# Altium schematic sheet RF_AMPL_001.SchDoc
size 594 x 420 mm; Author: UR4UUZ; CompanyName: UR4UUZ; SheetNumber: 1; SheetTotal: 1; PageSetup: Record=PageOptions|CenterHorizontal=True|CenterVertical=True|PrintScale=0.94|XCorrection=1.00|YCorrection=1.00|PrintKind=1|BorderSize=5000000|LeftOffset=0|BottomOffset=0|Orientation=1|PaperLength=1000|PaperWidth=1000|Scale=100|PaperSource=7|PrintQuality=-4|MediaType=1|DitherType=10|PaperKind=A4|PrintScaleMode=1; DecimalNumber: Підсилювач КХ-діапазону; DocumentName: Sheet1.SCHDOC
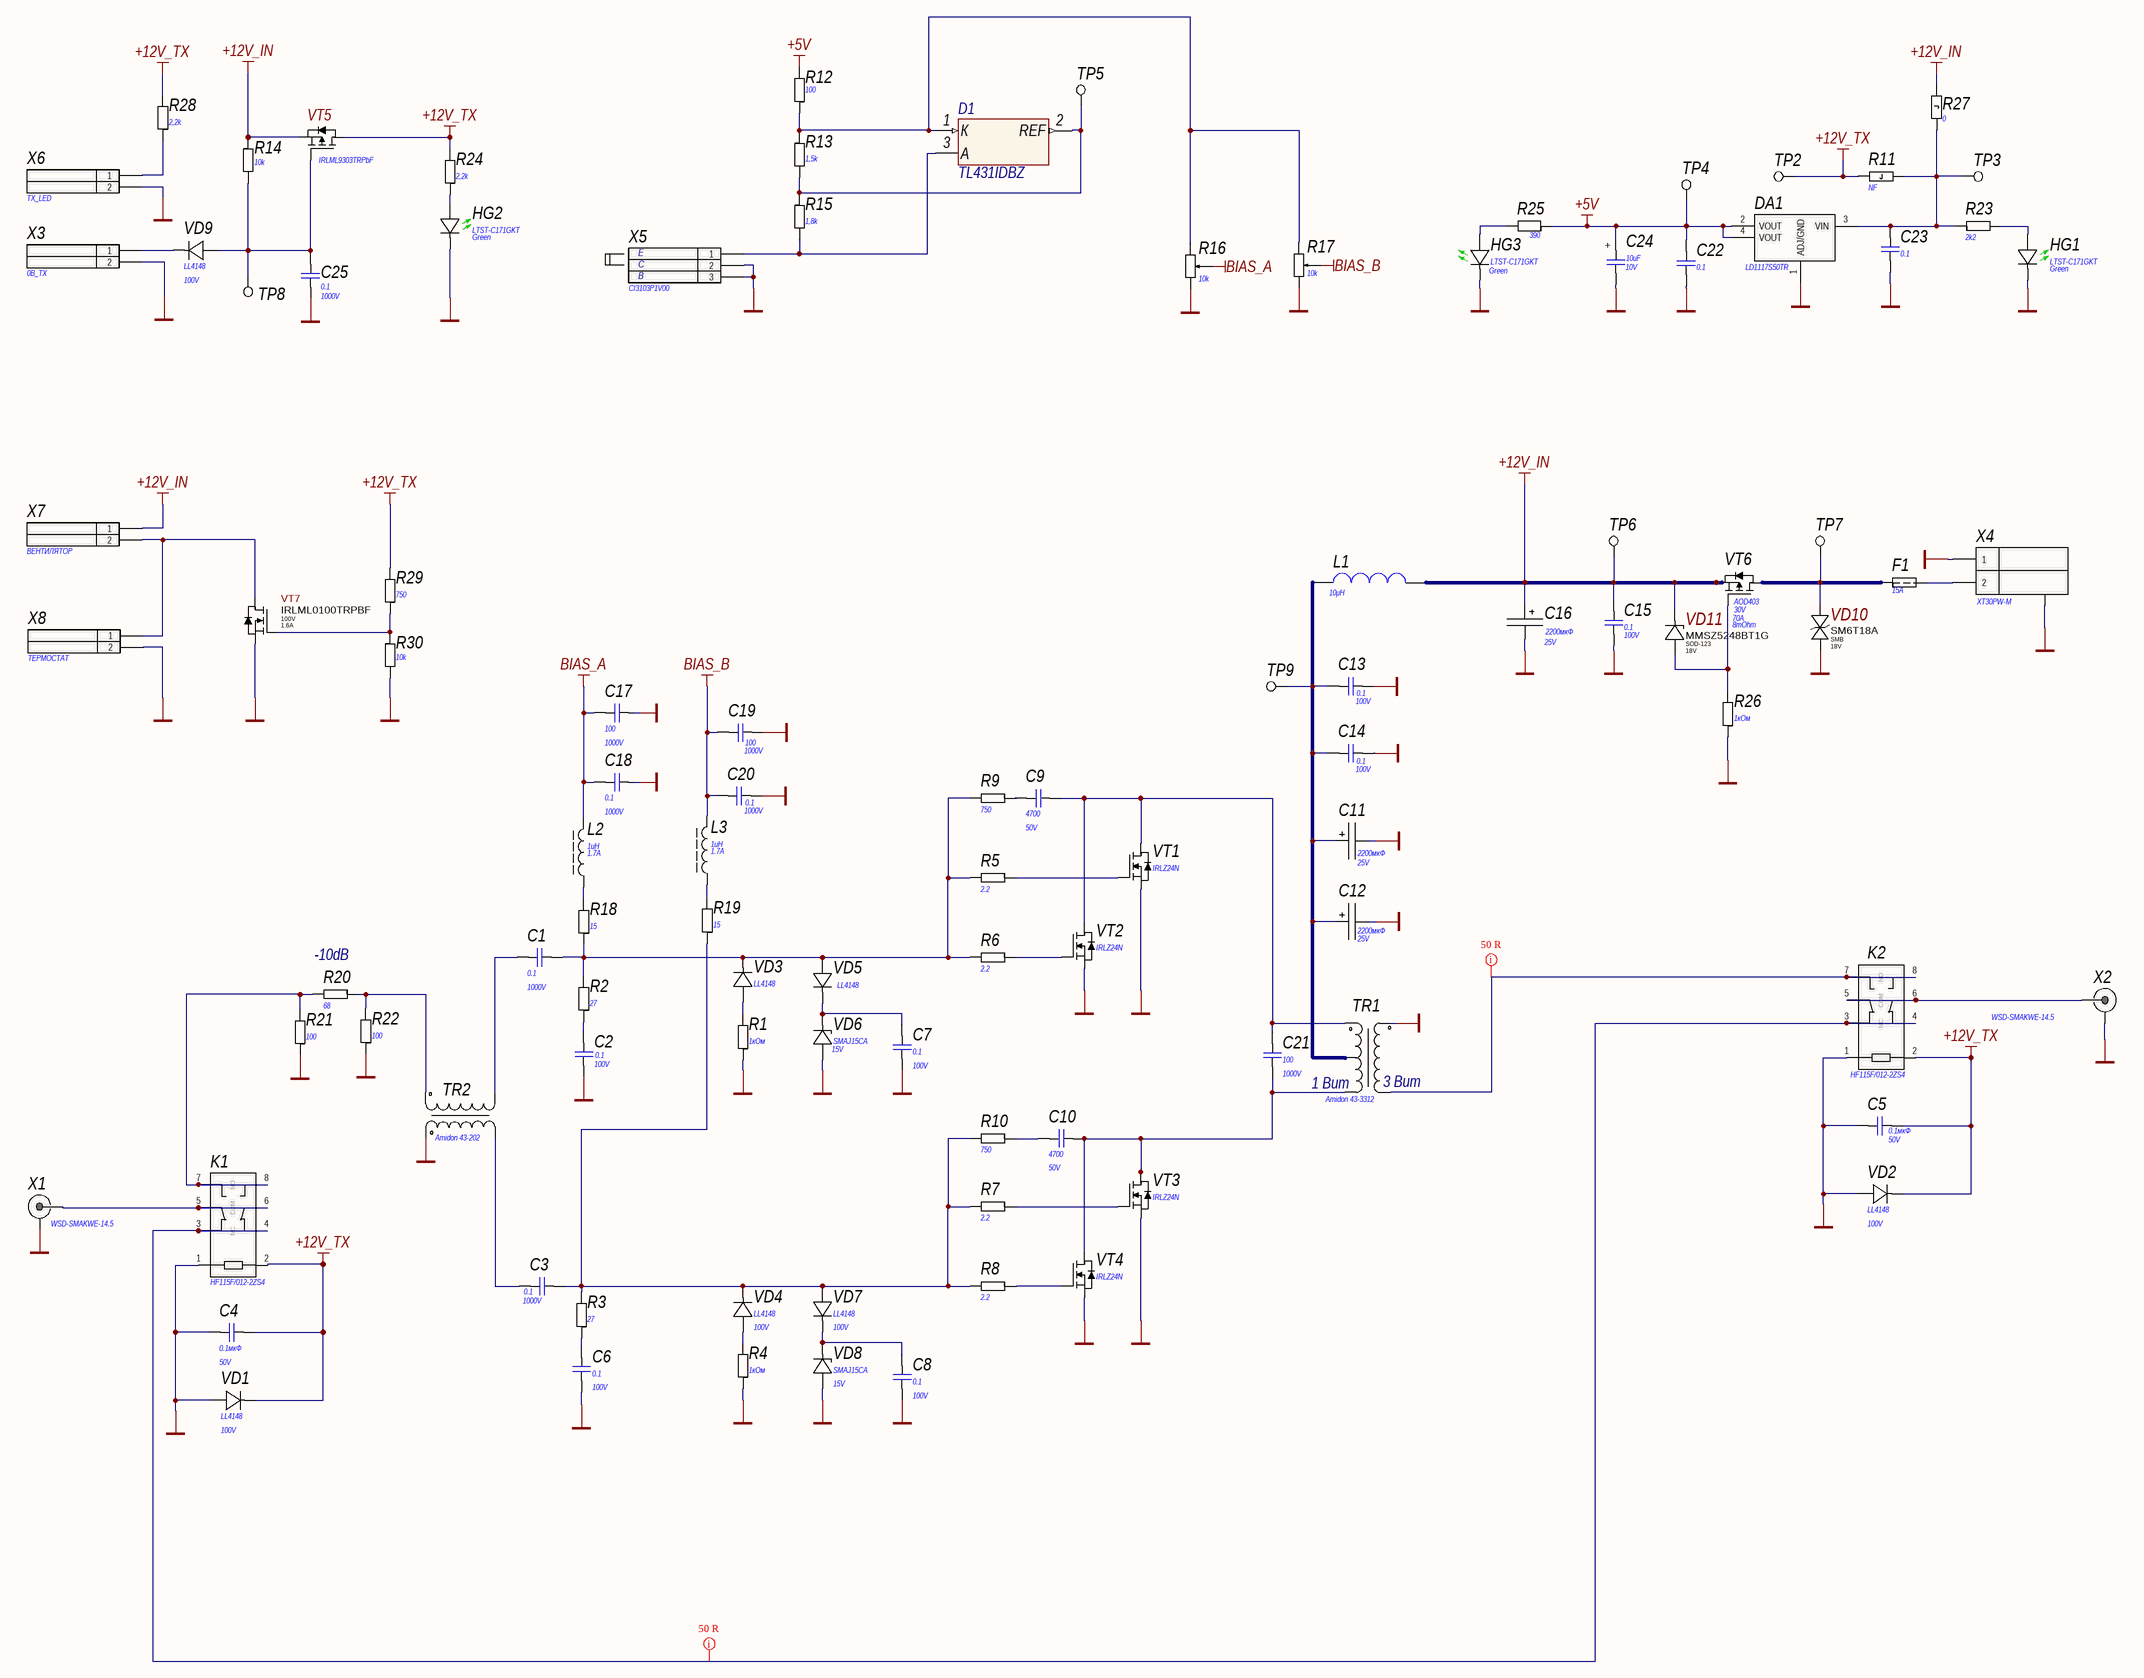
[diagram p0: RF_AMPL_001.SchDoc]

## Parts
C1  Voltage: 1000V  [C_CERAMIC_1206_MED]  (hidden comment: 0.1)
C2  Voltage: 100V  [C_CERAMIC_1206_MED]  (hidden comment: 0.1)
C3  Voltage: 1000V  [C_CERAMIC_1206_MED]  (hidden comment: 0.1)
C4  value 0.1мкФ  Voltage: 50V  [C_CERAMIC_0805_HI]  (hidden comment: 18pF)
C5  value 0.1мкФ  Voltage: 50V  [C_CERAMIC_0805_HI]  (hidden comment: 18pF)
C6  Voltage: 100V  [C_CERAMIC_1206_MED]  (hidden comment: 0.1)
C7  Voltage: 100V  [C_CERAMIC_1206_MED]  (hidden comment: 0.1)
C8  Voltage: 100V  [C_CERAMIC_1206_MED]  (hidden comment: 0.1)
C9  value 4700  Voltage: 50V  [C_CERAMIC_1206_MED]  (hidden comment: 0.1)
C10  value 4700  Voltage: 50V  [C_CERAMIC_1206_MED]  (hidden comment: 0.1)
C11  value 2200мкФ  Voltage: 25V  [CAP: D13C5H20]
C12  value 2200мкФ  Voltage: 25V  [CAP: D13C5H20]
C13  Voltage: 100V  [C_CERAMIC_1206_MED]  (hidden comment: 0.1)
C14  Voltage: 100V  [C_CERAMIC_1206_MED]  (hidden comment: 0.1)
C15  Voltage: 100V  [C_CERAMIC_1206_MED]  (hidden comment: 0.1)
C16  value 2200мкФ  Voltage: 25V  [CAP: D13C5H20]
C17  Voltage: 1000V  [C_CERAMIC_1206_MED]  (hidden comment: 100)
C18  Voltage: 1000V  [C_CERAMIC_1206_MED]  (hidden comment: 0.1)
C19  Voltage: 1000V  [C_CERAMIC_1206_MED]  (hidden comment: 100)
C20  Voltage: 1000V  [C_CERAMIC_1206_MED]  (hidden comment: 0.1)
C21  Voltage: 1000V  [C_CERAMIC_1206_MED]  (hidden comment: 100)
C22  0.1  [C_CERAMIC_1206_MED]
C23  0.1  [C_CERAMIC_1206_MED]
C24  Voltage: 10V  [C_TANTAL_CASE_A_MED]  (hidden comment: 10uF)
C25  Voltage: 1000V  [C_CERAMIC_1206_MED]  (hidden comment: 0.1)
D1  (no value)  [SOT23-3_300X250X110]
DA1  LD1117S50TR  [SOT-223]
F1  Current: 15A  [17861640001]  (hidden comment: STANDART_FUSE_HOLDER)
HG1  Color: Green  [LTST-C171GKT]  (hidden comment: LTST-C171GKT)
HG2  Color: Green  [LTST-C171GKT]  (hidden comment: LTST-C171GKT)
HG3  Color: Green  [LTST-C171GKT]  (hidden comment: LTST-C171GKT)
K1  HF115F/012-2ZS4  [HF115Fxxx-1(2)Zx3(4)]
K2  HF115F/012-2ZS4  [HF115Fxxx-1(2)Zx3(4)]
L1  value 10μH  [IND: R22.9/14/7.62 (H)]
L2  Current: 1.7A  [LQM21PNxxxxGRx_MED]  (hidden comment: 1uH)
L3  Current: 1.7A  [LQM21PNxxxxGRx_MED]  (hidden comment: 1uH)
R1  1кОм  [R_ANY_CHIP_1206_MED]
R2  27  [FKN2WS-Series]
R3  27  [FKN2WS-Series]
R4  1кОм  [R_ANY_CHIP_1206_MED]
R5  2.2  [R_ANY_CHIP_1206_MED]
R6  2.2  [R_ANY_CHIP_1206_MED]
R7  2.2  [R_ANY_CHIP_1206_MED]
R8  2.2  [R_ANY_CHIP_1206_MED]
R9  750  [R_ANY_CHIP_1206_MED]
R10  750  [R_ANY_CHIP_1206_MED]
R11  NF  [R_ANY_CHIP_1206_MED]
R12  100  [R_ANY_CHIP_1206_MED]
R13  1,5k  [R_ANY_CHIP_1206_MED]
R14  10k  [R_ANY_CHIP_1206_MED]
R15  1,8k  [R_ANY_CHIP_1206_MED]
R16  10k  [3296W-1-xxx]
R17  10k  [3296W-1-xxx]
R18  15  [R_ANY_CHIP_1206_MED]
R19  15  [R_ANY_CHIP_1206_MED]
R20  68  [FKN2WS-Series]
R21  100  [FKN2WS-Series]
R22  100  [FKN2WS-Series]
R23  2k2  [R_ANY_CHIP_1206_MED]
R24  2,2k  [R_ANY_CHIP_1206_MED]
R25  390  [R_ANY_CHIP_1206_MED]
R26  1кОм  [R_ANY_CHIP_1206_MED]
R27  0  [R_ANY_CHIP_1206_MED]
R28  2,2k  [R_ANY_CHIP_1206_MED]
R29  750  [R_ANY_CHIP_1206_MED]
R30  10k  [R_ANY_CHIP_1206_MED]
TP2  PAD-1.75mm  [PAD-1.75mm]  (value not drawn)  (no BOM)
TP3  PAD-1.75mm  [PAD-1.75mm]  (value not drawn)  (no BOM)
TP4  PAD-1.75mm  [PAD-1.75mm]  (value not drawn)  (no BOM)
TP5  PAD-1.75mm  [PAD-1.75mm]  (value not drawn)  (no BOM)
TP6  PAD-1.75mm  [PAD-1.75mm]  (value not drawn)  (no BOM)
TP7  PAD-1.75mm  [PAD-1.75mm]  (value not drawn)  (no BOM)
TP8  PAD-1.75mm  [PAD-1.75mm]  (value not drawn)  (no BOM)
TP9  PAD-1.75mm  [PAD-1.75mm]  (value not drawn)  (no BOM)
TR1  Part Number: Amidon 43-3312  [Amidon_43-3312]  (hidden comment: TR)
TR2  Part Number: Amidon 43-202  [Amidon_43-202]  (hidden comment: TR)
VD1  Voltage: 100V  [SOD-80C_MED]  (hidden comment: LL4148)
VD2  Voltage: 100V  [SOD-80C_MED]  (hidden comment: LL4148)
VD3  LL4148  [SOD-80C_MED]
VD4  Voltage: 100V  [SOD-80C_MED]  (hidden comment: LL4148)
VD5  LL4148  [SOD-80C_MED]
VD6  Voltage: 15V  [SMA_MED]  (hidden comment: SMAJ15CA)
VD7  Voltage: 100V  [SOD-80C_MED]  (hidden comment: LL4148)
VD8  Voltage: 15V  [SMA_MED]  (hidden comment: SMAJ15CA)
VD9  Voltage: 100V  [SOD-80C_MED]  (hidden comment: LL4148)
VD10  Package: SMB  Voltage: 18V  [SMB-Bi1_MED]  (hidden comment: SM6T18A)
VD11  Package: SOD-123  Voltage: 18V  [SOD-123_MED]  (hidden comment: MMSZ5248BT1G)
VT1  IRLZ24N  [TO220(H)]
VT2  IRLZ24N  [TO220(H)]
VT3  IRLZ24N  [TO220(H)]
VT4  IRLZ24N  [TO220(H)]
VT5  IRLML9303TRPbF  [SOT-23_MED]
VT6  Vds: 30V  Id: 70A  Rds: 8mOhm  [DPAK_REC]  (hidden comment: AOD403)
VT7  Vds: 100V  Id: 1.6A  [SOT-23_MED]  (hidden comment: IRLML0100TR)
X1  WSD-SMAKWE-14.5  [KLS1-SMA002]
X2  WSD-SMAKWE-14.5  [KLS1-SMA002]
X3  Part Number: 0B_TX  [WF-2R]  (hidden comment: WH-02R)
X4  XT30PW-M  [XT30PW-M]
X5  WH-03S  [WF-3S]  (value not drawn)
X6  Part Number: TX_LED  [WF-2R]  (hidden comment: WH-02R)
X7  Part Number: ВЕНТИЛЯТОР  [WF-2R]  (hidden comment: WH-02R)
X8  Part Number: ТЕРМОСТАТ  [WF-2R]  (hidden comment: WH-02R)

## Nets
+5V: C22.1 C24.1 DA1.2(VOUT) DA1.4(VOUT) R12.1 R25.2 TP4.1
+12V_IN: C15.2 C16.1 L1.1 R14.2 R27.1 TP6.1 VD11.CA VT5.2(S) VT6.3(S) X7.1
+12V_TX: C4.2 C5.2 K1.2(COIL2) K2.2(COIL2) R11.2 R24.1 R28.1 R29.1 TP2.1 VD1.CA VD2.CA VT5.3(D)
BIAS_A: C17.1 C18.1 L2.2 R16.2(WIPER)
BIAS_B: C19.1 C20.1 L3.2 R17.2(WIPER)
GND: C2.1 C4.1 C5.1 C6.1 C7.1 C8.1 C11.2 C12.2 C13.1 C14.1 C15.1 C16.2 C17.2 C18.2 C19.2 C20.2 C22.2 C23.2 C24.2 C25.2 DA1.1(ADJ/GND) HG1.CA(Cathode) HG2.CA(Cathode) HG3.CA(Cathode) K1.1(COIL1) K2.1(COIL1) R1.2 R4.2 R16.3(CW) R17.3(CW) R21.2 R22.2 R26.2 R30.1 TR1.1 TR2.1 VD1.AN VD2.AN VD6.AN VD8.AN VD10.AN1 VT1.3(S) VT2.3(S) VT3.3(S) VT4.3(S) VT7.2(S) X1.2 X2.2 X3.2 X4.1 X4.MP X5.2 X5.3 X6.2 X8.2
NetC1_1: C1.1 TR2.4
NetC1_2: C1.2 R2.1 R5.1 R6.1 R9.1 R18.2 VD3.CA VD5.AN
NetC2_2: C2.2 R2.2
NetC3_1: C3.1 TR2.2
NetC3_2: C3.2 R3.1 R7.1 R8.1 R10.1 R19.2 VD4.CA VD7.AN
NetC6_2: C6.2 R3.2
NetC7_2: C7.2 VD5.CA VD6.CA
NetC8_2: C8.2 VD7.CA VD8.CA
NetC9_1: C9.1 C21.2 TR1.3 VT1.2(D) VT2.2(D)
NetC9_2: C9.2 R9.2
NetC10_1: C10.1 C21.1 TR1.5 VT3.2(D) VT4.2(D)
NetC10_2: C10.2 R10.2
NetC11_1: C11.1 C12.1 C13.2 C14.2 L1.2 TP9.1 TR1.4
NetC23_1: C23.1 DA1.3(VIN) R11.1 R23.2 R27.2 TP3.1
NetC25_1: C25.1 R14.1 TP8.1 VD9.AN VT5.1(G)
NetD1_1: D1.1(К) R12.2 R13.2 R16.1(CCW) R17.1(CCW)
NetD1_2: D1.2(REF) R13.1 R15.2 TP5.1
NetD1_3: D1.3(A) R15.1 X5.1
NetF1_1: F1.1 TP7.1 VD10.AN2 VT6.2(D)
NetF1_2: F1.2 X4.2
NetHG1_AN: HG1.AN(Anode) R23.1
NetHG2_AN: HG2.AN(Anode) R24.2
NetHG3_AN: HG3.AN(Anode) R25.1
NetK1_3: K1.3(1-NC) K1.4(2-NC) K2.3(1-NC) K2.4(2-NC)
NetK1_5: K1.5(1-COM) K1.6(2-COM) X1.1
NetK1_7: K1.7(2-NO) K1.8(2-NO) R20.1 R21.1
NetK2_5: K2.5(1-COM) K2.6(2-COM) X2.1
NetK2_7: K2.7(2-NO) K2.8(2-NO) TR1.2
NetL2_1: L2.1 R18.1
NetL3_1: L3.1 R19.1
NetR1_1: R1.1 VD3.AN
NetR4_1: R4.1 VD4.AN
NetR5_2: R5.2 VT1.1(G)
NetR6_2: R6.2 VT2.1(G)
NetR7_2: R7.2 VT3.1(G)
NetR8_2: R8.2 VT4.1(G)
NetR20_2: R20.2 R22.1 TR2.3
NetR26_1: R26.1 VD11.AN VT6.1(G)
NetR28_2: R28.2 X6.1
NetR29_2: R29.2 R30.2 VT7.1(G)
NetVD9_CA: VD9.CA X3.1
NetVT7_3: VT7.3(D) X7.2 X8.1

## Layout directives
net class CPW: NetK1_3, NetK2_7

## Notes on the sheet
- E
- C
- B
- (near R20) -10dB
- (near TR1) 1 Вит
- (near TR1) 3 Вит
- Перв.примен.
- Справ.№
- Подп. и дата
- Инв.№ дубл.
- Взам.инв.№
- Подп.и дата
- Разраб.
- Изм.
- Лист
- № докум.
- Подп.
- Дата
- Лит.
- Масштаб
- Масса
- Т.контр.
- Пров.
- СХЕМА   ЭЛЕКТРИЧЕСКАЯ
- ПРИНЦИПИАЛЬНАЯ
- Листов
- Инв.№ подл.
- Утв.
- Н.контр.
- Нач.сект.
- Формат  A2
- (in symbol 293D106X9010A2TE3) +
- (in symbol HF115F/012-2ZS4) NO; COM; NC

## Library data of the parts
C1-C3 C6-C8 C13-C15 C17-C21 C25 = 1206B102K102CG: 1nF 1000V X7R ±10% 1206 Ceramic Capacitor RoHS; Manufacturer: Walsin; Standard Lead Time: 31 Weeks; Component Status: Released; Replacement: NONE; Package: 1206; Dielectric Type: X7R; Part Number: 1206B102K102CG; Part Type: Ceramic / X7R / 1206; Component Type: SMD; Temperature Range: -55°C ~ 125°C; Tolerance: ±10%; ComponentLink1URL: https://eu.mouser.com/datasheet/2/210/Middle_and_High_Voltage_DS-1535659.pdf; Supplier 1: Mouser; Supplier Part Number 1: 791-1206B102K102CT; Price: 0; ComponentLink1Description: Datasheet
  C1-C3 C6-C8 C13-C15 C18 C20 C25: Value: 0.1
  C17 C19 C21: Value: 100
C4 C5 = CERAMIC_0805: Part Number: **; Manufacturer: Hitano; Component Status: Released; Tolerance: ±5%; Replacement: NONE; GUID_1C: 32087c8a-96b8-11ea-ab61-0050569f2651; Dielectric Type: C0G/NP0; Part Type: Ceramic / C0G(NP0) / 0402; Component Type: SMD; Temperature Range: -55°C ~ 125°C; ComponentLink1URL: \\altiumdb.ajax.local\files\Datasheet\Capacitor\Hitano-MLCC.pdf; Price: 0; ComponentLink1Description: Datasheet; Package: 0805
C9 C10 = 1206B102K102CG: 1nF 1000V X7R ±10% 1206 Ceramic Capacitor RoHS; Part Number: 12065A472JAT2A; Manufacturer: Walsin; Standard Lead Time: 31 Weeks; Component Status: Released; Replacement: NONE; Package: 1206; Dielectric Type: X7R; Part Type: Ceramic / X7R / 1206; Component Type: SMD; Temperature Range: -55°C ~ 125°C; Tolerance: ±10%; ComponentLink1URL: https://eu.mouser.com/datasheet/2/210/Middle_and_High_Voltage_DS-1535659.pdf; Supplier 1: Mouser; Supplier Part Number 1: 791-1206B102K102CT; Price: 0; ComponentLink1Description: Datasheet
C11 C12 C16 = Aluminium: Manufacturer: Wurth; PartNumber: 860080475013; ValueManufacturerPartNumber: Aluminium capacitor, 2200мкФ, 25V, ±20%, 54mOhm, 14x10x5 mm, -55...+105°C; TypeCapacitor: Aluminium capacitor; Tolerance: ±20%; Impedance: 54mOhm; Package: 14x10x5 mm; HelpURL: https://www.digikey.com/product-detail/en/wurth-electronics-inc/860080475013/732-9029-1-ND/5728972; Temperature: -55...+105°C
C22 C23 = 1206B102K102CG: 1nF 1000V X7R ±10% 1206 Ceramic Capacitor RoHS; Manufacturer: Walsin; Voltage: 100V; Standard Lead Time: 31 Weeks; Component Status: Released; Replacement: NONE; Value: 0.1; Package: 1206; Dielectric Type: X7R; Part Number: 1206B102K102CG; Part Type: Ceramic / X7R / 1206; Component Type: SMD; Temperature Range: -55°C ~ 125°C; Tolerance: ±10%; ComponentLink1URL: https://eu.mouser.com/datasheet/2/210/Middle_and_High_Voltage_DS-1535659.pdf; Supplier 1: Mouser; Supplier Part Number 1: 791-1206B102K102CT; Price: 0; ComponentLink1Description: Datasheet
C24 = 293D106X9010A2TE3: 10uF 10V ±10% Case A Tantalum Capacitor RoHS, 3.4Ohm; Manufacturer: Vishay; Standard Lead Time: 20 Weeks; Component Status: Released; Dielectric Type: NONE; Part Number: 293D106X9010A2TE3; Part Type: Tantalum; Component Type: SMD; Temperature Range: -55°C ~ 125°C; Tolerance: ±10%; ComponentLink1URL: https://eu.mouser.com/datasheet/2/427/293d-1763499.pdf; Supplier 1: Mouser; Supplier Part Number 1: 74-293D106X9010A2TE3; Replacement: NONE; Price: 0.2178; ComponentLink1Description: Datasheet; Package: Case A; Value: 10uF
D1 = TL431IDBZ: Precision Programmable Reference SOT23-3; Manufacturer: Texas Instruments; Type: Мікросхема; Name: TL431IDBZ [Texas Instruments]; Component Function: Voltage Reference; Package: SOT23-3; Mount: SMT; Min Operating Temperature: -40°C; Max Operating Temperature: +85°C; ComponentLink1Description1: *; ComponentLink1Description: Datasheet Link; ComponentLink1Description: New link; Number of Pins: 4; Part Number: TL431IDBZ
DA1 = LD1117S50TR: Adjustable and fixed low drop positive voltage regulator, 5V 800mA, 1.25V to 15V Vin; Manufacturer: STMicroelectronics; Standard Lead Time: 14 Weeks; Component Status: Released; Replacement: NONE; Package: SOT-223; Part Number: LD1117S50TR; Part Type: Power / Linear Regulator; Component Type: SMD; Temperature Range: 0°C ~ 125°C; ComponentLink1URL: https://www.st.com/content/ccc/resource/technical/document/datasheet/99/3b/7d/91/91/51/4b/be/CD00000544.pdf/files/CD00000544.pdf/jcr:content/translations/en.CD00000544.pdf; Supplier 1: Digi-Key; Supplier Part Number 1: 497-6447-2-ND; Price: 0.66; ComponentLink1Description: Datasheet
F1 = STANDART_FUSE_HOLDER: Automotive Fuse holder THT-Mount; Manufacturer_Name: LITTELFUSE; Datasheet Link: https://www.littelfuse.com/media?resourcetype=2d-prints&itemid=dcb90cf3-0771-4ccd-8726-26101cf00574&filename=ol-178.6164.0000(c); Height: 17.5mm; Manufacturer_Part_Number: 17861640001
HG1-HG3 = LTST-C171GKT: Low Power LED, Green 565nm, Clear, SMD 0805, Vf 2.1V - 2.6V, 5 ~ 12mcd @ 20 mA, 130°; Manufacturer: Lite-On Optoelectronics; Component Status: Released; Replacement: NONE; GUID_1C: df39881f-c399-11eb-ab74-0050569f2651; Part Number: LTST-C171GKT; Part Type: LED / 0805; Component Type: SMD; Package: 0805; Wavelength: 565nm; Temperature Range: -55°C ~ 85°C; Supplier 1: Digi-Key; Supplier Part Number 1: 160-1423-2-ND; Price: 0.06; ComponentLink1Description: Datasheet
K1 K2 = HF115F/012-2ZS4: Miniature High Power Relay, DPDT (2 Form C), 12VDC 400mW Coil, 5.0mm 2 Pole 8A AgCdO; Manufacturer: Hongfa; Ajax_1C_ID: 38428; Ajax_1C_PN: HF115F/012-2ZS4 HONGFA, Реле; Ajax_1С_Status: RND Only; Component Status: Released; Replacement: NONE; GUID_1C: 4ba44618-64be-11ec-a90c-00505699469b; Part Number: HF115F/012-2ZS4; Part Type: Relay; Component Type: PTH; Temperature Range: -40°C ~ 85°C; ComponentLink1URL: https://www.tme.eu/Document/2962d862af219292e2e76bbc4b5ef3a2/hf115f.pdf; Supplier 1: TME; Supplier Part Number 1: HF115F/012-2ZS4; Price: 2.27649268; ComponentLink1Description: Datasheet
L1 = Inductor_R22.9/14/7.62: Manufacturer: Magnetics; PartNumber: 0077310A7; ValueManufacturerPartNumber: Fixed inductor, 10μH, ±20%, R22.9/14/7.62, Kool Mu, µ=125, 90 нГн/витков2; TypeInductor: Fixed inductor; TypeMatiriel: Kool Mu; AL: 90 нГн/витков2; MaterialPermeability: µ=125; Tolerance: ±20%; Package: R22.9/14/7.62; HelpURL: http://ferrite.ru/warehouse/r-22-9147-62-77310-a7.html
L2 L3 = LQM21PN1R0MGHL: 1uH Shielded Multilayer Inductor 1.7A 100mOhm Max, 0805; Manufacturer: Murata Electronics; Saturation Current: 1.5A; Tolerance: ±20%; Component Status: Released; Standard Lead Time: 10 Weeks; Replacement: NONE; Value: 1uH; Package: 0805; Part Number: LQM21PN1R0MGHL; Part Type: Power / Multilayer; Component Type: SMD; Temperature Range: -40°C ~ 85°C; ComponentLink1URL: https://eu.mouser.com/datasheet/2/281/1/JELF243B_0040-1699501.pdf; Supplier 1: Mouser; Supplier Part Number 1: 81-LQM21PN1R0MGHL; Price: NONE; ComponentLink1Description: Datasheet
R1 R4 R9 R10 R18 R19 R24 R26 R29 = RC1206FR-071RL: 1 Ohms ±1%, 1/4W 1206 Thick Film Resistor; Manufacturer: Yageo; Ajax_1C_ID: 11059; Ajax_1C_PN: 1R 1% 1206 Resistors SMD RoHS; Ajax_1С_Status: RND Only; Power Rating: 0.25W; Voltage: 200V; Component Status: Released; Temperature Stability: ±200ppm/°C; Replacement: NONE; GUID_1C: 50ee7b76-bfc7-11e7-8199-14dda9d2d04d; Tolerance: ±1%; Package: 1206; Part Number: RC1206FR-071RL; Component Type: SMD; Part Type: Thick Film; Temperature Range: -55°C ~ 155°C; ComponentLink1URL: https://eu.mouser.com/datasheet/2/447/PYu_RC_Group_51_RoHS_L_11-1984063.pdf; Supplier 1: Digi-Key; Supplier Part Number 1: 311-1.00FRTR-ND; Price: 0,0027; ComponentLink1Description: Datasheet
  R1 R4 R26: Value: 1кОм
  R9 R10 R29: Value: 750
  R18 R19: Value: 15
  R24: Value: 2,2k
R2 R3 = FKN2WSJT-73-22R: 22 Ohm ±5%, 2W d4.6mm L11.5mm Axial Through Hole, Fusible, Flameproof, Wirewound Resistor; Manufacturer: Yageo; Ajax_1C_ID: 55873; Ajax_1C_PN: 22R 5% 2W FKN2WSJT-73-22R YAGEO резистор выводной; Ajax_1С_Status: RND Only; Component Status: Released; Temperature Stability: ±350ppm/°C; Replacement: NONE; GUID_1C: 1e7de5d6-6f01-11ed-a366-005056994834; Tolerance: ±5%; Package: Axial 4.6mm, L11.5mm; Value: 27; Part Number: FKN2WSJT-73-22R; Component Type: PTH; Part Type: Wirewound; Power Rating: 2W; Temperature Range: -40°C ~ 155°C; ComponentLink1URL: https://www.yageo.com/upload/media/product/productsearch/datasheet/lr/YAGEO%20FKN_datasheet_2021v0.pdf; Supplier 1: Mouser; Supplier Part Number 1: 603-FKN2WSJT-73-22R; Price: 0,2524; ComponentLink1Description: Datasheet
R5-R8 = RC1206FR-072R4L: 2.42Ohms ±1%, 1/4W 1206 Thick Film Resistor; Manufacturer: Yageo; Ajax_1C_ID: 17368; Ajax_1C_PN: 2.4R 1% 1206 1/4W Resistors SMD RoHS; Ajax_1С_Status: Mass Production; Power Rating: 0.25W; Voltage: 200V; Component Status: Released; Temperature Stability: ±200ppm/°C; Replacement: NONE; GUID_1C: fdd97e3f-df6d-11e9-ab58-0050569f2651; Tolerance: ±1%; Package: 1206; Value: 2.2; Part Number: RC1206FR-072R4L; Component Type: SMD; Part Type: Thick Film; Temperature Range: -55°C ~ 155°C; ComponentLink1URL: https://eu.mouser.com/datasheet/2/447/Yageo_03_18_2021_PYu_RC_Group_51_RoHS_L_11-2199992.pdf; Supplier 1: Mouser; Supplier Part Number 1: 603-RC1206FR-072R4L; Price: 0,0021; ComponentLink1Description: Datasheet
R11 R27 = RC1206JR-070RL: 0 Ohms Jumper, 1/4W 1206 Thick Film Resistor; Manufacturer: Yageo; Tolerance: ±5%; Ajax_1C_ID: 5515; Ajax_1C_PN: 0R 5% 1206 Resistors SMD RoHS; Ajax_1С_Status: Mass Production; Power Rating: 0.25W; Voltage: 200V; Component Status: Released; Temperature Stability: NONE; GUID_1C: 96b6e750-6b2e-11e4-9c1d-a45d36c4a9e5; Package: 1206; Part Number: RC1206JR-070RL; Component Type: SMD; Part Type: Thick Film; Temperature Range: -55°C ~ 155°C; ComponentLink1URL: https://eu.mouser.com/datasheet/2/447/PYu_RC_Group_51_RoHS_L_10-1664068.pdf; Supplier 1: Digi-Key; Supplier Part Number 1: 311-0.0ERTR-ND; Replacement: NONE; Price: 0,0018; ComponentLink1Description: Datasheet
  R11: Value: NF
  R27: Value: 0
R12 = RC1206JR-0710KL: 100 kOhms ±5% 1/4W 1206 Thick Film Resistor; Manufacturer: Yageo; Ajax_1C_ID: 29423; Ajax_1C_PN: 10k 5% 1206 Resistors SMD RoHS; Ajax_1С_Status: RND Only; Power Rating: 0.25W; Voltage: 200V; Component Status: Released; Temperature Stability: ±100ppm/°C; Replacement: NONE; GUID_1C: e3e7c694-a8f0-11eb-ab74-0050569f2651; Tolerance: ±5%; Package: 1206; Value: 100; Part Number: RC1206JR-0710KL; Component Type: SMD; Part Type: Thick Film; Temperature Range: -55°C ~ 155°C; ComponentLink1URL: https://eu.mouser.com/datasheet/2/447/PYu_RC_Group_51_RoHS_L_11-1984063.pdf; Supplier 1: Digi-Key; Supplier Part Number 1: 311-10KERTR-ND; Price: 0,0018; ComponentLink1Description: Datasheet
R13 = RC1206JR-0710KL: 1,5k kOhms ±5% 1/4W 1206 Thick Film Resistor; Manufacturer: Yageo; Ajax_1C_ID: 29423; Ajax_1C_PN: 10k 5% 1206 Resistors SMD RoHS; Ajax_1С_Status: RND Only; Power Rating: 0.25W; Voltage: 200V; Component Status: Released; Temperature Stability: ±100ppm/°C; Replacement: NONE; GUID_1C: e3e7c694-a8f0-11eb-ab74-0050569f2651; Tolerance: ±5%; Package: 1206; Value: 1,5k; Part Number: RC1206JR-0710KL; Component Type: SMD; Part Type: Thick Film; Temperature Range: -55°C ~ 155°C; ComponentLink1URL: https://eu.mouser.com/datasheet/2/447/PYu_RC_Group_51_RoHS_L_11-1984063.pdf; Supplier 1: Digi-Key; Supplier Part Number 1: 311-10KERTR-ND; Price: 0,0018; ComponentLink1Description: Datasheet
R14 R30 = RC1206JR-0710KL: 10 kOhms ±5% 1/4W 1206 Thick Film Resistor; Manufacturer: Yageo; Ajax_1C_ID: 29423; Ajax_1C_PN: 10k 5% 1206 Resistors SMD RoHS; Ajax_1С_Status: RND Only; Power Rating: 0.25W; Voltage: 200V; Component Status: Released; Temperature Stability: ±100ppm/°C; Replacement: NONE; GUID_1C: e3e7c694-a8f0-11eb-ab74-0050569f2651; Tolerance: ±5%; Package: 1206; Value: 10k; Part Number: RC1206JR-0710KL; Component Type: SMD; Part Type: Thick Film; Temperature Range: -55°C ~ 155°C; ComponentLink1URL: https://eu.mouser.com/datasheet/2/447/PYu_RC_Group_51_RoHS_L_11-1984063.pdf; Supplier 1: Digi-Key; Supplier Part Number 1: 311-10KERTR-ND; Price: 0,0018; ComponentLink1Description: Datasheet
R15 = RC1206JR-0710KL: 1,8k kOhms ±5% 1/4W 1206 Thick Film Resistor; Manufacturer: Yageo; Ajax_1C_ID: 29423; Ajax_1C_PN: 10k 5% 1206 Resistors SMD RoHS; Ajax_1С_Status: RND Only; Power Rating: 0.25W; Voltage: 200V; Component Status: Released; Temperature Stability: ±100ppm/°C; Replacement: NONE; GUID_1C: e3e7c694-a8f0-11eb-ab74-0050569f2651; Tolerance: ±5%; Package: 1206; Value: 1,8k; Part Number: RC1206JR-0710KL; Component Type: SMD; Part Type: Thick Film; Temperature Range: -55°C ~ 155°C; ComponentLink1URL: https://eu.mouser.com/datasheet/2/447/PYu_RC_Group_51_RoHS_L_11-1984063.pdf; Supplier 1: Digi-Key; Supplier Part Number 1: 311-10KERTR-ND; Price: 0,0018; ComponentLink1Description: Datasheet
R16 R17 = 3296W-1-103LF: 10 kOhms ±10% Trimmer Resistor, 0.5W, Through Hole 3/8", 4.83x9.53mm, 10.03mm Height; Manufacturer: Bourns; Ajax_1C_PN: NONE; Ajax_1С_Status: RND Only; Component Status: On Review; Temperature Stability: ±100ppm/°C; Tolerance: ±10%; Package: 4.83x9.53mm; Value: 10k; Part Number: 3296W-1-103LF; Component Type: PTH; Part Type: Trimming Potentiometer; Power Rating: 0.5W; Temperature Range: -55°C ~ 125°C; ComponentLink1URL: https://www.bourns.com/data/global/pdfs/3296.pdf; Supplier 1: Mouser; Supplier Part Number 1: 652-3296W-1-103LF; Replacement: NONE; Price: NONE; ComponentLink1Description: Datasheet
R20 = FKN2WSJT-73-22R: 68 Ohm ±5%, 2W d4.6mm L11.5mm Axial Through Hole, Fusible, Flameproof, Wirewound Resistor; Manufacturer: Yageo; Ajax_1C_ID: 55873; Ajax_1C_PN: 22R 5% 2W FKN2WSJT-73-22R YAGEO резистор выводной; Ajax_1С_Status: RND Only; Component Status: Released; Temperature Stability: ±350ppm/°C; Replacement: NONE; GUID_1C: 1e7de5d6-6f01-11ed-a366-005056994834; Tolerance: ±5%; Package: Axial 4.6mm, L11.5mm; Value: 68; Part Number: FKN2WSJT-73-22R; Component Type: PTH; Part Type: Wirewound; Power Rating: 2W; Temperature Range: -40°C ~ 155°C; ComponentLink1URL: https://www.yageo.com/upload/media/product/productsearch/datasheet/lr/YAGEO%20FKN_datasheet_2021v0.pdf; Supplier 1: Mouser; Supplier Part Number 1: 603-FKN2WSJT-73-22R; Price: 0,2524; ComponentLink1Description: Datasheet
R21 R22 = FKN2WSJT-73-22R: 100 Ohm ±5%, 2W d4.6mm L11.5mm Axial Through Hole, Fusible, Flameproof, Wirewound Resistor; Manufacturer: Yageo; Ajax_1C_ID: 55873; Ajax_1C_PN: 22R 5% 2W FKN2WSJT-73-22R YAGEO резистор выводной; Ajax_1С_Status: RND Only; Component Status: Released; Temperature Stability: ±350ppm/°C; Replacement: NONE; GUID_1C: 1e7de5d6-6f01-11ed-a366-005056994834; Tolerance: ±5%; Package: Axial 4.6mm, L11.5mm; Value: 100; Part Number: FKN2WSJT-73-22R; Component Type: PTH; Part Type: Wirewound; Power Rating: 2W; Temperature Range: -40°C ~ 155°C; ComponentLink1URL: https://www.yageo.com/upload/media/product/productsearch/datasheet/lr/YAGEO%20FKN_datasheet_2021v0.pdf; Supplier 1: Mouser; Supplier Part Number 1: 603-FKN2WSJT-73-22R; Price: 0,2524; ComponentLink1Description: Datasheet
R23 = RC1206FR-071RL: 2k2 Ohms ±1%, 1/4W 1206 Thick Film Resistor; Manufacturer: Yageo; Ajax_1C_ID: 11059; Ajax_1C_PN: 1R 1% 1206 Resistors SMD RoHS; Ajax_1С_Status: RND Only; Power Rating: 0.25W; Voltage: 200V; Component Status: Released; Temperature Stability: ±200ppm/°C; Replacement: NONE; GUID_1C: 50ee7b76-bfc7-11e7-8199-14dda9d2d04d; Tolerance: ±1%; Package: 1206; Value: 2k2; Part Number: RC1206FR-071RL; Component Type: SMD; Part Type: Thick Film; Temperature Range: -55°C ~ 155°C; ComponentLink1URL: https://eu.mouser.com/datasheet/2/447/PYu_RC_Group_51_RoHS_L_11-1984063.pdf; Supplier 1: Digi-Key; Supplier Part Number 1: 311-1.00FRTR-ND; Price: 0,0027; ComponentLink1Description: Datasheet
R25 = RC1206FR-071RL: 390 Ohms ±1%, 1/4W 1206 Thick Film Resistor; Manufacturer: Yageo; Ajax_1C_ID: 11059; Ajax_1C_PN: 1R 1% 1206 Resistors SMD RoHS; Ajax_1С_Status: RND Only; Power Rating: 0.25W; Voltage: 200V; Component Status: Released; Temperature Stability: ±200ppm/°C; Replacement: NONE; GUID_1C: 50ee7b76-bfc7-11e7-8199-14dda9d2d04d; Tolerance: ±1%; Package: 1206; Value: 390; Part Number: RC1206FR-071RL; Component Type: SMD; Part Type: Thick Film; Temperature Range: -55°C ~ 155°C; ComponentLink1URL: https://eu.mouser.com/datasheet/2/447/PYu_RC_Group_51_RoHS_L_11-1984063.pdf; Supplier 1: Digi-Key; Supplier Part Number 1: 311-1.00FRTR-ND; Price: 0,0027; ComponentLink1Description: Datasheet
R28 = RC1206FR-071RL: 2,2 kOhms ±1%, 1/4W 1206 Thick Film Resistor; Manufacturer: Yageo; Ajax_1C_ID: 11059; Ajax_1C_PN: 1R 1% 1206 Resistors SMD RoHS; Ajax_1С_Status: RND Only; Power Rating: 0.25W; Voltage: 200V; Component Status: Released; Temperature Stability: ±200ppm/°C; Replacement: NONE; GUID_1C: 50ee7b76-bfc7-11e7-8199-14dda9d2d04d; Tolerance: ±1%; Package: 1206; Value: 2,2k; Part Number: RC1206FR-071RL; Component Type: SMD; Part Type: Thick Film; Temperature Range: -55°C ~ 155°C; ComponentLink1URL: https://eu.mouser.com/datasheet/2/447/PYu_RC_Group_51_RoHS_L_11-1984063.pdf; Supplier 1: Digi-Key; Supplier Part Number 1: 311-1.00FRTR-ND; Price: 0,0027; ComponentLink1Description: Datasheet
TP2-TP9 = PAD-1.75mm: 1.75mm Pad for Plug-In or Receptacle; Ajax_1C_PN: NONE; Ajax_1С_Status: RND Only; Component Status: Released; Part Number: PAD-1.75mm; Component Type: PTH; Manufacturer: NONE; Part Type: Pad; Temperature Range: NONE; ComponentLink1URL: NONE; Replacement: NONE; Price: NONE; ComponentLink1Description: Datasheet
TR1 = Amidon_43-3312: Manufacturer: Handmade; Saturation Current: 11.3A; Tolerance: ±20%; ComponentLink1Description: Datasheet; ComponentLink1URL: https://www.vishay.com/docs/34193/ihlp-4040dz-01.pdf
TR2 = Amidon_43-202: Manufacturer: Handmade; Saturation Current: 11.3A; Tolerance: ±20%; ComponentLink1Description: Datasheet; ComponentLink1URL: https://www.vishay.com/docs/34193/ihlp-4040dz-01.pdf
VD1-VD5 VD7 VD9 = LL4148: Fast Switching Diode, 100V 200 mA, SOD-80C; Manufacturer: Suntan; Marking: NONE; Component Status: Released; Current: 200mA; Vf: 1V @ 10mA; Part Number: LL4148; Package: SOD-80; Part Type: Fast Switching; Component Type: SMD; Standard Lead Time: NONE; Temperature Range: -65°C ~ 175°C; Replacement: NONE; Price: 0.02625203; ComponentLink1Description: Datasheet
  VD3 VD5: Voltage: 100V
VD6 VD8 = SMAZ30-13-F: Zener Diode 15V, 1W, ±5%, SMA; Manufacturer: Diodes Incorporated; Marking: ZJQ; Component Status: Released; Standard Lead Time: 18 Weeks; Replacement: NONE; Part Number: SMAJ15CA; Package: SMA; Part Type: Zener; Component Type: SMD; Temperature Range: -65°C ~ 150°C; Supplier 1: Mouser; Supplier Part Number 1: 621-SMAZ30-F; Price: 0.144; ComponentLink1Description: Datasheet
VD10 = 1.5SMB47CA: TVS Diode 18V Clamp, 23.5A (10/1000us) Ipp, SMB; Manufacturer: Littelfuse; Marking: C15F; Component Status: Released; Standard Lead Time: 16 Weeks; Replacement: NONE; Part Number: SM6T18A; Part Type: TVS / ESD Protection; Component Type: SMD; Current: 23.5A; Temperature Range: -65°C ~ 150°C; Supplier 1: Digi-Key; Supplier Part Number 1: 18-1.5SMB47CATR-ND; Price: 0.24614587; ComponentLink1Description: Datasheet
VD11 = MMSZ5248BT1G: Zener Diode 18V, 500mW, ±5%, SOD-123; Manufacturer: Onsemi; Marking: J3; Component Status: Released; Standard Lead Time: 14 Weeks; Replacement: NONE; Part Number: MMSZ5248BT1G; Part Type: Zener; Component Type: SMD; Temperature Range: -55°C ~ 150°C; Supplier 1: Digi-Key; Supplier Part Number 1: MMSZ5248BT1GOSTR-ND; Price: 0.065; ComponentLink1Description: Datasheet
VT1-VT4 = N-CH_MOSFET: N-MOSFET; полевой;; Part Type: N-Channel; Component Type: SMD; Package: D-PAK; ComponentLink1Description: Datasheet; ComponentLink1URL: https://www.tme.eu/Document/dd9e9fcbccf7c5b1f5f9da06cbc5bf44/AOD403-DTE.pdf; Part Number: IRLZ24N
VT5 = IRLML9301TRPbF: -30V, -3.6A max P-Channel HEXFET MOSFET, 82mOhm @ Vgs = -4.5V; Manufacturer: Infineon Technologies; Component Status: Released; Standard Lead Time: 77 Weeks; Replacement: NONE; Vds: 30V; Id: 3.6A; Rds: 103mOhm; Part Type: P-Channel; Component Type: SMD; Temperature Range: -55°C ~ 150°C; ComponentLink1URL: https://eu.mouser.com/datasheet/2/196/Infineon_IRLML9301_DataSheet_v01_01_EN-1732998.pdf; Supplier 1: Mouser; Supplier Part Number 1: IRLML9301TRPbF; Price: 0.05229076; ComponentLink1Description: Datasheet; Part Number: IRLML9301TRPbF; Package: SOT-23
VT6 = AOD4189: -30V, 70A max P-Channel Power MOSFET, 8mOhm @ Vgs = 20V; Manufacturer: Alpha & Omega Semiconductor Inc.; Component Status: Review; Standard Lead Time: 16 Weeks; Replacement: NONE; Part Number: AOD403; Package: D-Pak; Part Type: P-Channel; Component Type: SMD; Temperature Range: -55°C ~ 175°C; ComponentLink1URL: https://www.aosmd.com/sites/default/files/res/datasheets/AOD4189.pdf; Supplier 1: Digi-Key; Supplier Part Number 1: 785-1351-2-ND; Price: NONE; ComponentLink1Description: Datasheet
VT7 = IRLML0100TRPBF: 100V, 1.6A max N-Channel HEXFET Power MOSFET, 190mOhm @ Vgs = 4.5V; Manufacturer: Infineon Technologies; Rds: 220mOhm; Component Status: Released; Standard Lead Time: 13 Weeks; Replacement: NONE; Part Number: IRLML0100TRPBF; Package: SOT-23; Part Type: N-Channel; Component Type: SMD; Temperature Range: -55°C ~ 150°C; ComponentLink1URL: https://www.infineon.com/dgdl/irlml0100pbf.pdf?fileId=5546d462533600a4015356649d9225e8; Supplier 1: Digi-Key; Supplier Part Number 1: IRLML0100TRPBFTR-ND; Price: 0.071; ComponentLink1Description: Datasheet
X1 X2 = WSD-SMAKWE-14.5: 50Ohm SMA Connector, Right Angle, Female, 5.1mm; Manufacturer: Wangshen Development LLC; Replacement: NONE; Part Number: WSD-SMAKWE-14.5; Part Type: RF Connector; Component Type: PTH; Temperature Range: -55°C ~ 155°C; Price: NONE; ComponentLink1Description: Datasheet
X3 X6-X8 = CI3102P1H00: WH Series 2.54mm Wire to Board Right Angle DIP Type Headers, 2 Pin; Manufacturer: CviLux; Replacement: NONE; Part Type: Wire-to-Board / Header; Component Type: PTH; Temperature Range: -25℃ ~ 85℃; Price: 0.017; ComponentLink1Description: Datasheet
X4 = XT30PW-M: 2 Pin DC Power Socket, XT30, Male, THT, Right Angle, Yellow, 15A, 500V; Manufacturer: Amass; Replacement: NONE; Part Number: XT30PW-M; Part Type: Power Socket; Component Type: PTH; Temperature Range: -20°C ~ 120°C; Supplier 1: TME; Supplier Part Number 1: XT30PW-M; Price: 0.37753379; ComponentLink1Description: Datasheet
X5 = CI3103P1V00: WH Series 2.54mm Wire to Board Straight DIP Type Headers, 3 Pin; Manufacturer: CviLux; Replacement: NONE; Part Number: CI3103P1V00; Part Type: Wire-to-Board / Header; Component Type: PTH; Temperature Range: -25℃ ~ 85℃; Price: 0.04922256; ComponentLink1Description: Datasheet